# EAGLE design TPM2.0 (EAGLE 8.2.1)
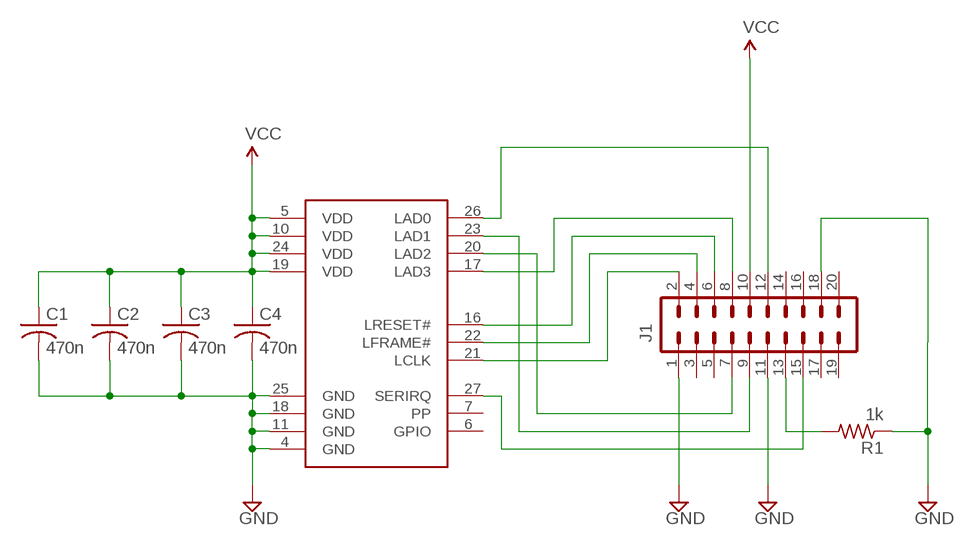
[diagram p0: schematic, sheet 1]

## Parts
C1  470n  C-USC0805K  [C0805K]
C2  470n  C-USC0805K  [C0805K]
C3  470n  C-USC0805K  [C0805K]
C4  470n  C-USC0805K  [C0805K]
J1  M10X22X10_LOCK  [2X10_LOCK]
R1  1k  R-US_R0805  [R0805]
U$1  SLB9965  [INF-PG-TSSOP-28-16_M_1PRIMARY]

## Nets
GND: C1.2 C2.2 C3.2 C4.2 J1.1 J1.11 J1.18 R1.1 U$1.4(GND) U$1.11(GND) U$1.18(GND) U$1.25(GND)
N$1: J1.2 U$1.21(LCLK)
N$2: J1.4 U$1.22(LFRAME#)
N$3: J1.6 U$1.16(LRESET#)
N$4: J1.8 U$1.17(LAD3)
N$5: J1.12 U$1.26(LAD0)
N$7: J1.7 U$1.20(LAD2)
N$8: J1.9 U$1.23(LAD1)
N$9: J1.15 U$1.27(SERIRQ)
N$10: J1.13 R1.2
VCC: C1.1 C2.1 C3.1 C4.1 J1.10 U$1.5(VDD) U$1.10(VDD) U$1.19(VDD) U$1.24(VDD)
Unconnected: J1.3 J1.5 J1.14 J1.16 J1.17 J1.19 J1.20 U$1.6(GPIO) U$1.7(PP)

## Library data of the parts
C1-C4 = adafruit:C-US: CAPACITOR, American symbol
J1 = SparkFun-Connectors:M10X2: This was SPECIALLY designed to be used with our Graphic LCD Backpack. Be sure you want to use this! It is not only staggered on each line of header holes, but IT IS ALSO offset of the center point of the top and bottom lines by 5 mil. This causes the headers to lock into place on the "standard" footprint on the LCD screen. The extra squares on the tdocu layer are there simply to reference other pins (if you were to actually populate a longer header than ten long - this is what we do with the backpacks).
R1 = adafruit:R-US_: RESISTOR, American symbol
U$1 = INF-PG-TSSOP-28-16_M:SLB9965

## Board
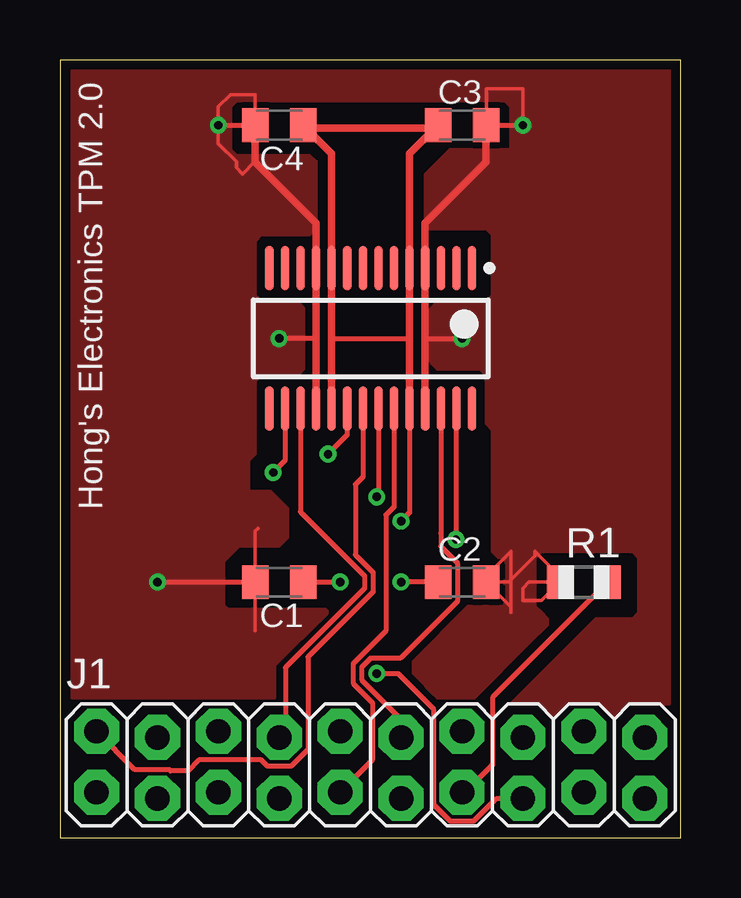
[diagram p1: board, top side]
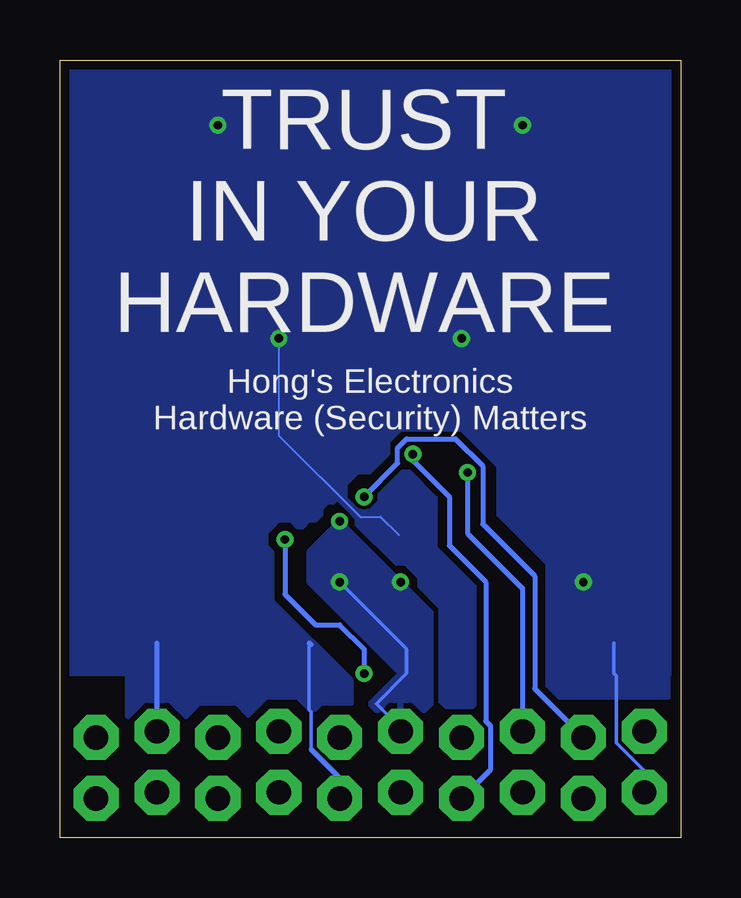
[diagram p2: board, bottom side, seen from below]

Size 25.89 x 32.44 mm. Coordinates in mm from the lower left corner, seen from the top.
Outline: 0,0 25.89,0 25.89,32.44 0,32.44 0,0
Copper layers (1*16): Top 0.0356mm / dielectric 1.5011mm / Bottom 0.0356mm
Design rules "LaenPCBOrder": minimum track width 6mil, minimum drill 13mil, track to track 6mil, track to pad 6mil, pad to pad 6mil, via to via 6mil, smd to smd 6mil, copper to edge 15mil, drill to drill 6mil, minimum pad ring 7mil, minimum via ring 7mil, stop-mask expansion 3mil, vias tented up to drill 0mil, thermal gap 10mil

### Footprints (pad centres in the part's own frame; a part is rotated, then mirrored left to right if it is on the bottom)
C0805K = smd 1.1 x 1.4: 1 -1,0; 2 1,0
2X10_LOCK = drill 1.016 pad 1.88 octagon: 1 -11.43,-1.143; 2 -11.43,1.397; 3 -8.89,-1.397; 4 -8.89,1.143; 5 -6.35,-1.143; 6 -6.35,1.397; 7 -3.81,-1.397; 8 -3.81,1.143; 9 -1.27,-1.143; 10 -1.27,1.397; 11 1.27,-1.397; 12 1.27,1.143; 13 3.81,-1.143; 14 3.81,1.397; 15 6.35,-1.397; 16 6.35,1.143; 17 8.89,-1.143; 18 8.89,1.397; 19 11.43,-1.397; 20 11.43,1.143
R0805 = smd 1.1 x 1.4: 1 -1,0; 2 1,0
INF-PG-TSSOP-28-16_M_1PRIMARY = smd 1.85 x 0.35: 1 -2.925,4.225; 2 -2.925,3.575; 3 -2.925,2.925; 4 -2.925,2.275; 5 -2.925,1.625; 6 -2.925,0.975; 7 -2.925,0.325; 8 -2.925,-0.325; 9 -2.925,-0.975; 10 -2.925,-1.625; 11 -2.925,-2.275; 12 -2.925,-2.925; 13 -2.925,-3.575; 14 -2.925,-4.225; 15 2.925,-4.225; 16 2.925,-3.575; 17 2.925,-2.925; 18 2.925,-2.275; 19 2.925,-1.625; 20 2.925,-0.975; 21 2.925,-0.325; 22 2.925,0.325; 23 2.925,0.975; 24 2.925,1.625; 25 2.925,2.275; 26 2.925,2.925; 27 2.925,3.575; 28 2.925,4.225

### Placement (x,y rotation side)
C1  9.14,10.67 180 top
C2  16.76,10.67 0 top
C3  16.76,29.72 0 top
C4  9.14,29.72 180 top
J1  12.95,3.05 0 top
R1  21.84,10.67 0 top
U$1  12.95,20.83 270 top

### Tracks (layer width: path | path; a pad name or v marks a point on that pad's centre or on a via)
GND  (via drill 0.35)
  Top 0.152: C2.2 18.72,10.67 19.81,11.76 19.81,11.94 20.84,10.91 R1.1 20.07,9.91 19.3,9.91 19.3,10.41 19.56,10.67 R1.1 | C2.2 17.76,10.91 18.8,11.94 18.8,9.4 18.8,9.64 C2.2 | C4.2 8.14,30.97 8.13,30.99 7.11,30.99 6.6,30.48 6.6,28.96 7.37,28.19 7.37,27.94 7.62,27.69 8.14,28.21 8.14,29.47 | 8.13,8.64 8.14,8.65 C1.2 8.14,12.79 8.26,12.9 | C3.2 17.78,29.73 17.78,31.24 19.3,31.24 v19.3,29.72 C3.2
  Top 0.203: v4.06,10.67 C1.2 | 10.68,20.83 v9.14,20.83 | 15.23,20.83 v16.76,20.83 | v6.6,29.72 C4.2 | C3.2 v19.3,29.72
  Top 0.305: U$1.25 15.23,20.83 U$1.4 15.23,25.64 17.76,28.18 C3.2 | U$1.18 10.68,20.83 U$1.11 10.68,25.64 8.14,28.18 8.14,29.47
  Bottom 0.076: v16.76,20.83 16.76,16.79 13.36,13.39 12.52,13.39 11.76,12.62
  Bottom 0.152: J1.1 1.52,2.79 2.69,3.96 2.69,6.76 2.79,6.86 2.79,8.13 | 15.42,3.7 15.42,5.26 15.49,5.33 15.49,7.98 15.42,8.05
  Bottom 0.203: J1.11 14.22,2.5 15.42,3.7 | 15.42,8.05 15.49,8.13 | J1.18 21.84,8.13
  pour Bottom: 0.25,32.26 25.65,32.26 25.65,6.86 14.22,6.86 18.03,10.67 18.03,17.02 15.49,19.56 7.87,19.56 6.6,18.29 6.6,13.21 5.33,11.94 5.33,10.67 2.79,6.86 0.25,6.86
  pour Bottom: 20.57,5.08 20.07,5.59 18.8,5.59 18.54,5.59 18.03,5.08 17.53,5.59 17.27,5.84 16,5.84 15.49,5.33 15.24,5.33 14.99,5.59 13.72,5.59 13.72,6.35 14.22,6.86 20.57,6.86
  pour Bottom: 20.57,6.86 20.57,5.08 20.83,4.83 22.86,4.83 23.11,5.08 23.11,6.86
  pour Bottom: 15.24,5.33 15.49,5.33 15.75,5.59 15.75,6.86 14.99,6.86 14.99,5.59
  pour Bottom: 5.33,10.67 5.33,6.6 4.57,5.84 0.51,5.84 0.51,6.86 1.52,6.86
  pour Top: 2.54,5.84 0.51,5.84 0.51,32 25.4,32 25.4,5.59 23.88,5.59 23.62,5.59 23.11,5.08 22.61,5.59 21.08,5.59 20.57,5.08 20.07,5.59 18.8,5.59 22.35,9.14 23.88,9.14 24.13,9.4 24.13,11.43 24.13,11.68 23.88,11.94 20.07,11.94 19.81,11.68 19.81,9.65 20.07,9.4 20.32,9.14 20.32,8.89 19.56,8.13 17.27,5.84 16,5.84 15.75,5.84 14.73,6.86 14.73,7.37 17.02,9.65 18.54,9.65 18.54,11.43 18.03,11.94 18.03,17.02 17.78,17.27 17.78,19.3 17.53,19.56 15.75,19.56 15.24,20.07 15.24,21.84 15.75,22.35 17.53,22.35 17.78,22.35 18.03,22.61 18.03,24.89 18.03,25.15 17.78,25.4 15.24,25.4 15.24,27.69 16,28.45 16.26,28.7 17.27,28.7 18.8,28.7 18.8,30.48 18.54,30.73 7.37,30.73 7.11,30.48 7.11,28.7 7.37,28.45 10.41,28.45 10.67,28.19 10.67,25.4 10.41,25.15 8.38,25.15 8.13,24.89 8.13,22.61 8.38,22.35 9.91,22.35 10.16,22.1 10.16,19.81 10.16,19.56 9.91,19.3 8.38,19.3 8.13,19.05 8.13,16.51 8.13,16 7.87,15.75 7.87,13.46 7.11,12.7 5.59,11.18 5.59,6.6 4.83,5.84
  pour Bottom: 15.49,20.07 6.1,20.07 5.59,19.56
  pour Bottom: 4.57,5.84 5.08,5.84 5.59,6.35 5.59,11.43 7.62,13.46 7.62,15.49 9.14,17.02 11.68,17.02 12.19,16.51 12.19,16 12.95,15.24 13.46,15.24 13.72,14.99 13.97,14.73 13.97,14.22 14.22,14.22 14.48,13.97 14.73,13.97 14.99,13.72 14.99,13.46 15.24,13.21 15.49,13.21 15.75,12.95 16,12.95 16.26,13.21 16.76,13.21 17.02,12.95 17.27,12.7 17.27,12.19 17.02,11.94 17.02,11.18 17.02,9.91 13.72,6.6 13.72,5.59 13.97,5.59 18.8,10.41 18.8,17.53 18.54,17.53 16,20.07 7.62,20.07 7.11,19.56 6.1,19.56 4.06,17.53 4.06,12.19 1.78,9.91 1.78,8.64
  pour Bottom: 13.94,14.2 13.49,13.74 13.44,13.69 12.95,13.69 12.6,14.05 12.6,14.35 11.63,15.32 11.3,15.32 10.19,14.2 10.19,12.14 8.56,10.52 8.56,5.51 8.66,5.41 9.8,5.41 10.06,5.66 10.06,9.58 10.95,10.46 10.95,10.82 11.51,11.38 11.89,11.38 13.54,13.03 13.54,13.28 14.2,13.94 14.38,14.12 14.38,14.25 14.38,14.38 14.3,14.45 14.2,14.45
  pour Top: 2.72,5.84 8.94,5.84 8.94,7.19 11.13,9.37 11.13,9.47 11.07,9.53 8.74,9.53 7.01,9.53 6.83,9.7 6.83,11.53 7.47,12.17 9.14,12.17 9.5,12.52 9.5,13.74 8.79,14.45 6.63,14.45 2.72,10.54
N$1
  Top 0.203: U$1.21 12.63,15.05 12.32,14.74 12.32,11.8 13.06,11.07 13.06,10.26 10.34,7.54 10.34,3.7 9.64,3 8.65,3 8.4,3.25 5.79,3.25 5.33,2.79 4.61,2.79 4.56,2.85 3.12,2.85 J1.2
N$2  (via drill 0.35)
  Top 0.203: U$1.22 13.28,14.22 v13.21,14.22
  Bottom 0.203: v13.21,14.22 11.81,15.62 11.81,16.26 11.44,16.63 9.39,16.63 8.26,15.5 8.26,13.08 6.1,10.92 6.1,6.22 J1.4
N$3  (via drill 0.35)
  Top 0.203: U$1.16 9.38,15.73 v8.89,15.24
  Bottom 0.203: v8.89,15.24 8.89,12.7 6.6,10.41 J1.6
N$4
  Top 0.203: U$1.17 10.03,13.59 12.7,10.92 12.7,10.41 9.4,7.11 9.4,4.45 J1.8
N$5
  Top 0.203: U$1.26 15.88,12.71 15.88,12.16 16.57,11.47 16.57,9.86 14.2,7.49 12.95,7.49 12.58,7.12 12.58,6.6 14.22,4.95 J1.12
N$7  (via drill 0.35)
  Top 0.203: U$1.20 11.98,16.8 v11.18,16
  Bottom 0.203: v11.18,16 11.18,15.75 9.65,14.22 9.65,12.19 8.13,10.67 8.13,4.86 7.95,4.68 7.95,2.85 J1.7
N$8
  Top 0.203: U$1.23 13.93,13.81 13.59,13.47 13.59,8.64 12.22,7.27 12.22,6.45 13.03,5.64 13.03,3.25 J1.9
N$9  (via drill 0.35)
  Top 0.203: U$1.27 16.53,12.46 v16.51,12.45 | v13.21,6.86 14.1,6.86 15.57,5.38 15.57,1.41 16.27,0.71 17.26,0.71 18.2,1.65 J1.15
  Bottom 0.203: v16.51,12.45 16.51,10.16 15.24,8.89 14.22,8.89 13.21,7.87 v13.21,6.86
N$10
  Top 0.203: R1.2 18.03,5.86 18.03,3.05 16.89,1.91 J1.13
VCC  (via drill 0.35)
  Top 0.203: 11.33,20.83 14.58,20.83 | C1.1 v11.68,10.67 | C2.1 v14.22,10.67 | U$1.24 14.58,13.56 v14.22,13.21
  Top 0.305: U$1.19 11.33,20.83 U$1.10 11.33,28.53 C4.1 10.28,29.58 15.63,29.58 | U$1.24 14.58,20.83 U$1.5 14.58,28.53 15.63,29.58 | 15.63,29.58 C3.1
  Bottom 0.152: J1.10 11.68,4.57 12.7,5.59 11.43,6.86 11.43,7.87 v14.22,10.67
  pour Bottom: 14.22,13.21 10.41,9.4 10.41,5.59 11.68,4.32 12.95,5.59 11.68,6.86 15.49,10.67 15.49,11.94

### Text on the board
tPlace: Hong's Electronics TPM 2.0
bPlace: TRUST / IN YOUR / HARDWARE | Hong's Electronics / Hardware (Security) Matters